# Altium schematic sheet XM-05 Typical Application Circuit.SchDoc: XM-05 Bluetooth Module Typical Application Circuit
size A4
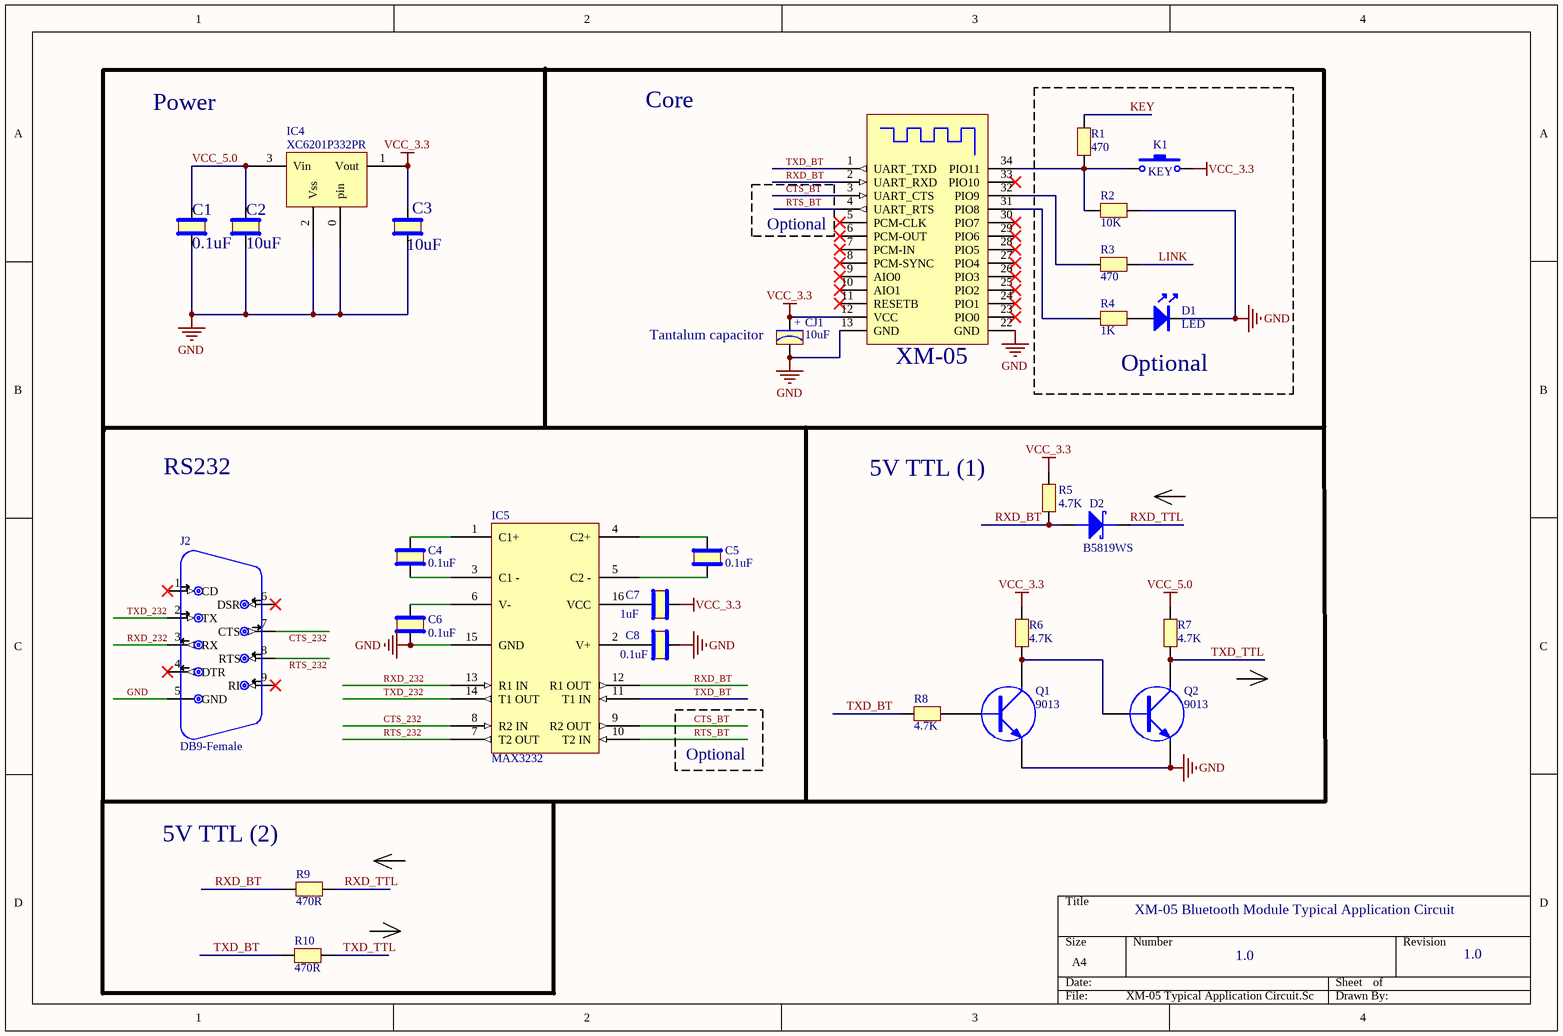
[diagram p0: XM-05 Typical Application Circuit.SchDoc]

## Parts
*1  XM-05
C1  0.1uF  [0603.RC]
C2  10uF  [0603.RC]
C3  10uF  [0603.RC]
C4  0.1uF  [0603.RC]
C5  0.1uF  [0603.RC]
C6  0.1uF  [0603.RC]
C7  1uF  [0603.RC]
C8  0.1uF  [0603.RC]
CJ1  10uF  [1206.DC]
D1  LED  [0603+]
D2  B5819WS  [SOD-323 - SMT]
IC4  XC6201P332PR  [SOT-89]
IC5  MAX3232  [SOP-16(N)]
J2  DB9-Female  [DB9-F - 90]
K1  KEY  [KEY-SS204]
Q1  9013  [SMT-SOT23MOS]
Q2  9013  [SMT-SOT23MOS]
R1  470  [0603.RC]
R2  10K  [0603.RC]
R3  470  [0603.RC]
R4  1K  [0603.RC]
R5  4.7K  [0603.RC]
R6  4.7K  [0603.RC]
R7  4.7K  [0603.RC]
R8  4.7K  [0603.RC]
R9  470R  [0603.RC]
R10  470R  [0603.RC]

## Blocks framed on the sheet
Optional: D1 K1 R1-R4

## Nets
GND: *1.13(GND) *1.22(GND) C1.1 C2.1 C3.1 C6.1 C8.1 CJ1.K D1.K IC4.0(pin) IC4.2(Vss) IC5.15(GND) J2.5(GND) Q1.S Q2.S R2.1
VCC_3.3: *1.12(VCC) C3.2 C7.1 CJ1.A IC4.1(Vout) K1.1 R5.2 R6.2
VCC_5.0: C1.2 C2.2 IC4.3(Vin) R7.2
CTS_232: IC5.8(R2_IN)
CTS_BT: *1.3(UART_CTS) IC5.9(R2_OUT)
KEY: R1.2
LINK: R3.1
RTS_232: IC5.7(T2_OUT)
RTS_BT: *1.4(UART_RTS) IC5.10(T2_IN)
RXD_232: IC5.13(R1_IN) J2.3(RX)
RXD_BT: *1.2(UART_RXD) D2.1 IC5.12(R1_OUT) R5.1 R9.2
RXD_TTL: D2.2 R9.1
TXD_232: IC5.14(T1_OUT) J2.2(TX)
TXD_BT: *1.1(UART_TXD) IC5.11(T1_IN) R8.2 R10.2
TXD_TTL: Q2.D R7.1 R10.1
Net*1_31: *1.31(PIO8) R4.2
Net*1_32: *1.32(PIO9) R3.2
Net*1_34: *1.34(PIO11) K1.2 R1.1 R2.2
NetC4_1: C4.1 IC5.3(C1_-)
NetC4_2: C4.2 IC5.1(C1+)
NetC5_1: C5.1 IC5.4(C2+)
NetC5_2: C5.2 IC5.5(C2_-)
NetC6_2: C6.2 IC5.6(V-)
NetC7_2: C7.2 IC5.16(VCC)
NetC8_2: C8.2 IC5.2(V+)
NetD1_A: D1.A R4.1
NetQ1_D: Q1.D Q2.G R6.1
NetQ1_G: Q1.G R8.1

Not connected (* = marked no-connect by the designer): *1 5(PCM-CLK)* 6(PCM-OUT)* 7(PCM-IN)* 8(PCM-SYNC)* 9(AIO0)* 10(AIO1)* 11(RESETB)* 23(PIO0)* 24(PIO1)* 25(PIO2)* 26(PIO3)* 27(PIO4)* 28(PIO5)* 29(PIO6)* 30(PIO7)* 33(PIO10)*; J2 1(CD)* 4(DTR)* 6(DSR)* 7(CTS) 8(RTS) 9(RI)*

## Notes on the sheet
- Power
- Core
- (near *1) Optional
- (near CJ1) Tantalum capacitor
- RS232
- 5V TTL (1)
- Optional
- (near R9) 5V TTL (2)
- 1.0
- Labels drawn without touching a wire or pin: CTS_232, RTS_232
- (in symbol CAPJS) +

## Library data of the parts
*1 = XM-101
C1-C8 = CAP
CJ1 = CAPJS
D2 = DIODE SCHOTTKY: Schottky Diode
IC4 = XC6201P301PR
J2 = DB9-F
K1 = SW-KEYSMT1
Q1 Q2 = NPN: NPN Transistor
R1-R10 = RES